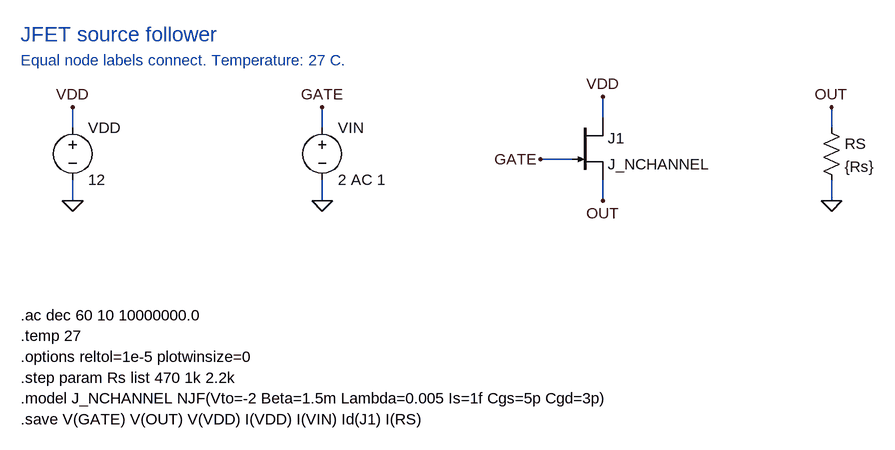
[diagram p0: schematic jfet-source-follower.asc]
jfet-source-follower.asc, the LTspice schematic file:
Version 4
SHEET 1 1740 776
WIRE 144 176 144 144
WIRE 144 256 144 288
WIRE 528 176 528 144
WIRE 528 256 528 288
WIRE 960 160 960 128
WIRE 912 224 864 224
WIRE 960 256 960 288
WIRE 1312 176 1312 144
WIRE 1312 256 1312 288
FLAG 144 144 VDD
FLAG 144 288 0
FLAG 528 144 GATE
FLAG 528 288 0
FLAG 960 128 VDD
FLAG 864 224 GATE
FLAG 960 288 OUT
FLAG 1312 144 OUT
FLAG 1312 288 0
SYMBOL voltage 144 160 R0
SYMATTR InstName VDD
SYMATTR Value 12
SYMBOL voltage 528 160 R0
SYMATTR InstName VIN
SYMATTR Value 2 AC 1
SYMBOL njf 912 160 R0
SYMATTR InstName J1
SYMATTR Value J_NCHANNEL
SYMBOL res 1296 160 R0
SYMATTR InstName RS
SYMATTR Value {Rs}
TEXT 64 32 Left 3 ;JFET source follower
TEXT 64 72 Left 2 ;Equal node labels connect. Temperature: 27 C.
TEXT 64 464 Left 2 !.ac dec 60 10 10000000.0
TEXT 64 496 Left 2 !.temp 27
TEXT 64 528 Left 2 !.options reltol=1e-5 plotwinsize=0
TEXT 64 560 Left 2 !.step param Rs list 470 1k 2.2k
TEXT 64 592 Left 2 !.model J_NCHANNEL NJF(Vto=-2 Beta=1.5m Lambda=0.005 Is=1f Cgs=5p Cgd=3p)
TEXT 64 624 Left 2 !.save V(GATE) V(OUT) V(VDD) I(VDD) I(VIN) Id(J1) I(RS)

The netlist it stands for:
* jfet-source-follower.asc
VDD VDD 0 12
VIN GATE 0 2 AC 1
J1 VDD GATE OUT J_NCHANNEL
RS OUT 0 {Rs}
.model NJF NJF
.model PJF PJF
.lib standard.jft
* JFET source follower
* Equal node labels connect. Temperature: 27 C.
.ac dec 60 10 10000000.0
.temp 27
.options reltol=1e-5 plotwinsize=0
.step param Rs list 470 1k 2.2k
.model J_NCHANNEL NJF(Vto=-2 Beta=1.5m Lambda=0.005 Is=1f Cgs=5p Cgd=3p)
.save V(GATE) V(OUT) V(VDD) I(VDD) I(VIN) Id(J1) I(RS)
.backanno
.end